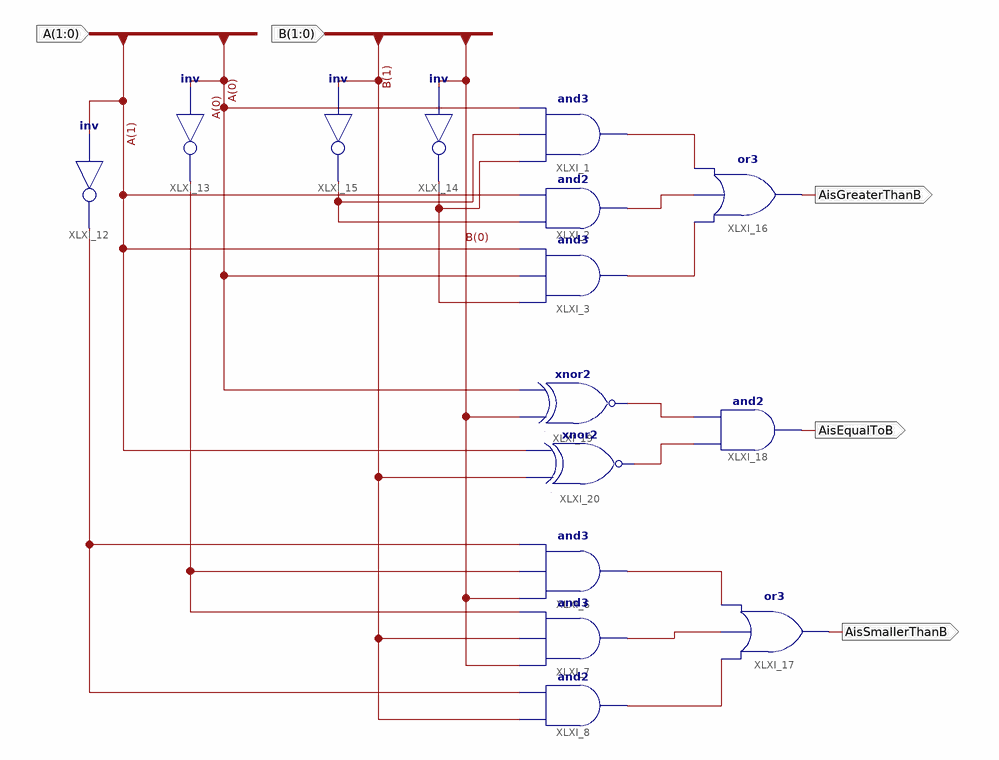
[diagram p0: schematic sheet 1]
// Xilinx ISE schematic TwoBitComparator.sch (artix7) as structural Verilog: 15 symbols, 5 ports
module TwoBitComparator (
  input  [1:0] A,
  input  [1:0] B,
  output AisGreaterThanB,
  output AisEqualToB,
  output AisSmallerThanB
);

  wire XLXN_9, XLXN_17, XLXN_22, XLXN_26, XLXN_29, XLXN_30, XLXN_31, XLXN_32, XLXN_33, XLXN_34, XLXN_36,
       XLXN_37;

  and XLXI_1 (XLXN_29, XLXN_22, XLXN_26, A[0]);
  and XLXI_2 (XLXN_30, XLXN_26, A[1]);
  and XLXI_3 (XLXN_31, XLXN_22, A[0], A[1]);
  and XLXI_6 (XLXN_34, B[0], XLXN_9, XLXN_17);
  and XLXI_7 (XLXN_36, B[0], B[1], XLXN_9);
  and XLXI_8 (XLXN_37, B[1], XLXN_17);
  not XLXI_12 (XLXN_17, A[1]);
  not XLXI_13 (XLXN_9, A[0]);
  not XLXI_14 (XLXN_22, B[0]);
  not XLXI_15 (XLXN_26, B[1]);
  or XLXI_16 (AisGreaterThanB, XLXN_31, XLXN_30, XLXN_29);
  or XLXI_17 (AisSmallerThanB, XLXN_37, XLXN_36, XLXN_34);
  and XLXI_18 (AisEqualToB, XLXN_33, XLXN_32);
  xnor XLXI_19 (XLXN_32, B[0], A[0]);
  xnor XLXI_20 (XLXN_33, B[1], A[1]);
endmodule
